# EasyEDA schematic SCH_Thunder-XVI_2026-04-16.json
TITLE: Esquemático - Thunder XVI; REV: 1.0; Date: 2025-11-13; Sheet: 1/1; Drawn By: mendesdiego; Company: GDAe
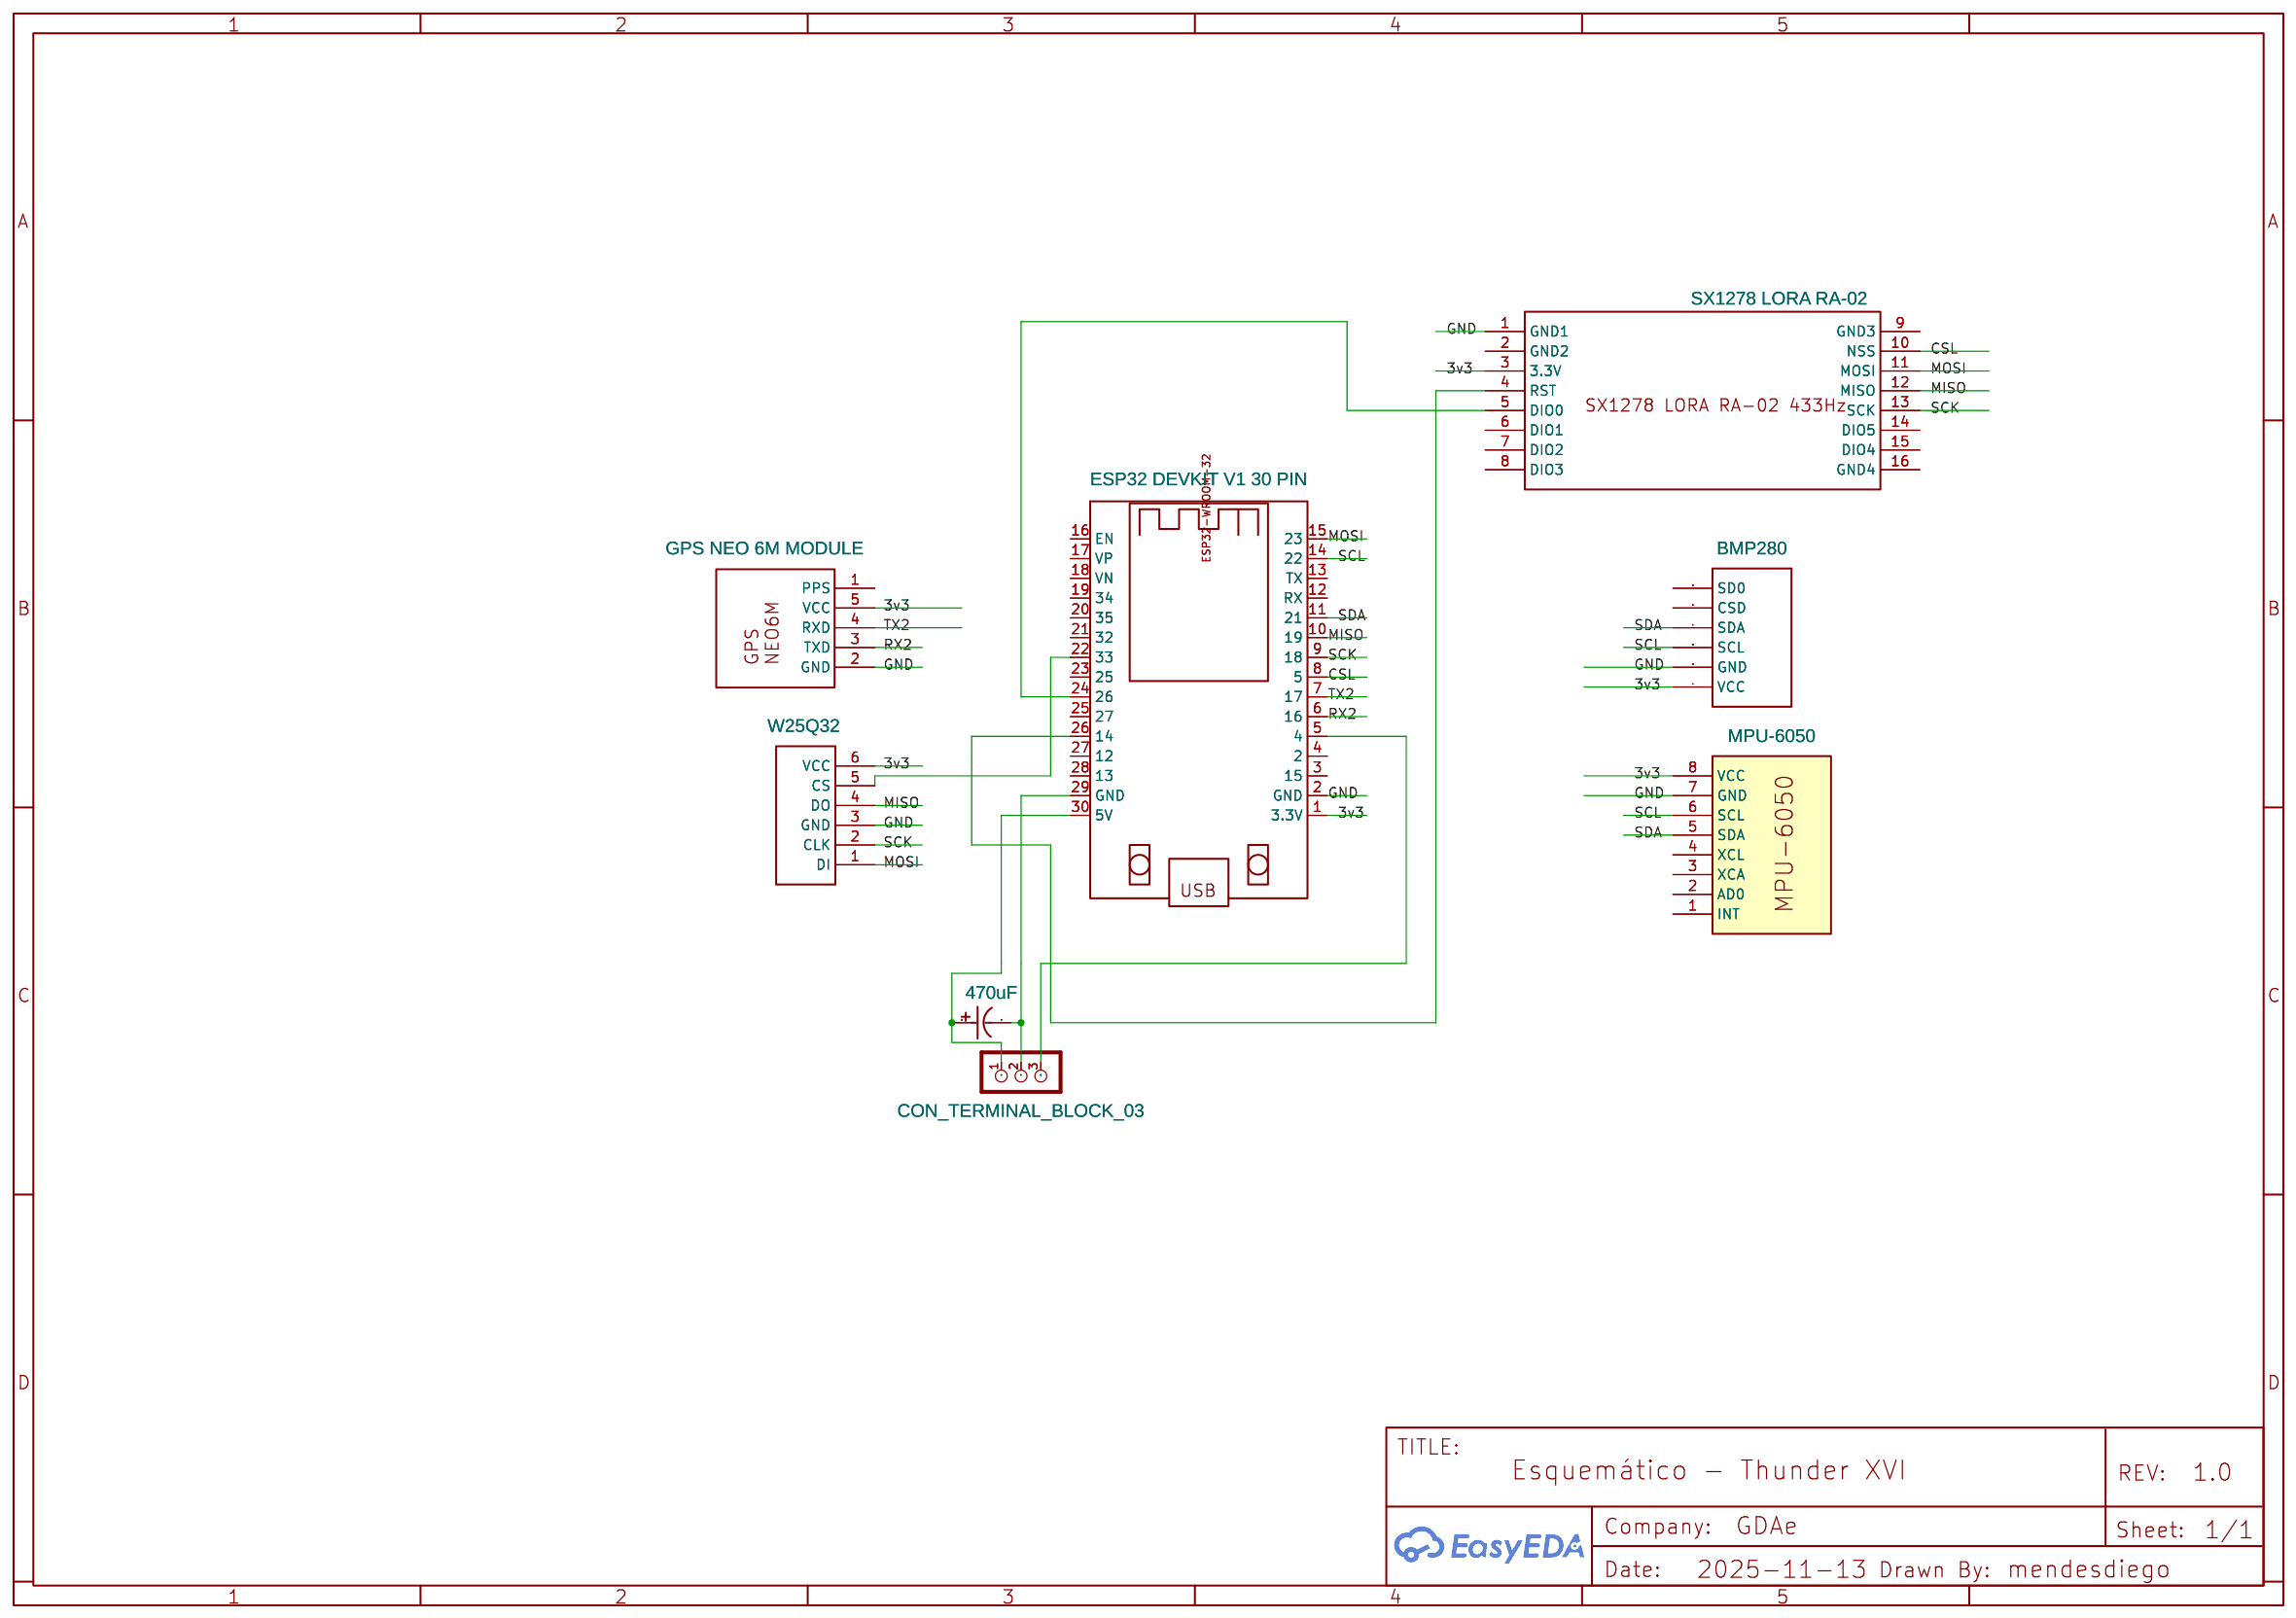
[diagram p0: schematic sheet]

## Parts
C1  470uF  [470UF/25V]
J1  CON_TERMINAL_BLOCK_03  [TERMINAL_BLOCK_3P_5]
P1  MPU-6050  [MPU6050]
U1  ESP32 DEVKIT V1 30 PIN  [ESP32 DEVKIT V1 30 PIN DEVBOARD]
U2  BMP280  [BMP280YSF BMP280YSF BMP280YSF BMP]
U3  GPS NEO 6M MODULE  [GPS MODULE GPS NEO-6M]
U4  W25Q32  [W25Q32]
U5  SX1278 LORA RA-02  [SX1278 LORA RA-02]

## Library data of the parts
C1 = 470uF Capacitor THT: Voltage: 25V; Supplier: EasyEDA; Contributor: R.M.Venkatraj
J1 = CON_TERMINAL_BLOCK_03: Contributor: DangerousPrototype
P1 = MPU-6050: sourceId: 1T5FDZYC8; Contributor: jgiral95
U1 = ESP32 DEVKIT V1 30 PIN DEVBOARD: Contributor: germanycsc
U2 = BMP280: Contributor: betelgeuse2
U3 = GPS NEO 6M MODULE: Contributor: Arkadiusz Wernicki
U4 = W25Q32: Contributor: arseniibrodnikov
U5 = SX1278 LORA RA-02: Supplier: Onixo; Contributor: shapna.khatun1960

## Nets
3v3: P1.8(VCC) U1.1(3.3V) U2.7(VCC) U3.5(VCC) U4.6(VCC) U5.3(3.3V)
GND: P1.7(GND) U1.2(GND) U2.6(GND) U3.2(GND) U4.3(GND) U5.1(GND1)
CSL: U1.8(5) U5.10(NSS)
MISO: U1.10(19) U4.4(DO) U5.12(MISO)
MOSI: U1.15(23) U4.1(DI) U5.11(MOSI)
RX2: U1.6(16) U3.3(TXD)
SCK: U1.9(18) U4.2(CLK) U5.13(SCK)
SCL: P1.6(SCL) U1.14(22) U2.5(SCL)
SDA: P1.5(SDA) U1.11(21) U2.4(SDA)
TX2: U1.7(17) U3.4(RXD)
Net-(C1-1): C1.1 J1.1 U1.30(5V)
Net-(C1-2): C1.2 J1.2 U1.29(GND)
Net-(J1-3): J1.3 U1.5(4)
Net-(U1-22): U1.22(33) U4.5(CS)
Net-(U1-24): U1.24(26) U5.5(DIO0)
Net-(U1-26): U1.26(14) U5.4(RST)

Not connected (* = marked no-connect by the designer): P1 1(INT) 2(AD0) 3(XCA) 4(XCL); U1 3(15) 4(2) 12(RX) 13(TX) 16(EN) 17(VP) 18(VN) 19(34) 20(35) 21(32) 23(25) 25(27) 27(12) 28(13); U2 2(SD0) 3(CSD); U3 1(PPS); U5 2(GND2) 6(DIO1) 7(DIO2) 8(DIO3) 9(GND3) 14(DIO5) 15(DIO4) 16(GND4)
